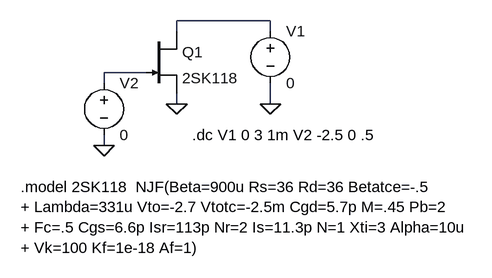
[diagram p0: schematic 2SK118.asc]
2SK118.asc, the LTspice schematic file:
Version 4
SHEET 1 1832 680
WIRE 368 -112 224 -112
WIRE 224 -96 224 -112
WIRE 368 -96 368 -112
WIRE 176 -32 112 -32
WIRE 112 -16 112 -32
WIRE 224 16 224 0
WIRE 368 16 368 -16
WIRE 112 80 112 64
FLAG 368 16 0
FLAG 224 16 0
FLAG 112 80 0
SYMBOL voltage 368 -112 R0
SYMATTR InstName V1
SYMATTR Value 0
SYMBOL njf 176 -96 R0
SYMATTR InstName Q1
SYMATTR Value 2SK118
SYMBOL voltage 112 -32 R0
SYMATTR InstName V2
SYMATTR Value 0
TEXT 248 64 Left 0 !.dc V1 0 3 1m V2 -2.5 0 .5
TEXT -16 144 Left 0 !.model 2SK118  NJF(Beta=900u Rs=36 Rd=36 Betatce=-.5\n+ Lambda=331u Vto=-2.7 Vtotc=-2.5m Cgd=5.7p M=.45 Pb=2\n+ Fc=.5 Cgs=6.6p Isr=113p Nr=2 Is=11.3p N=1 Xti=3 Alpha=10u\n+ Vk=100 Kf=1e-18 Af=1)

The netlist it stands for:
* 2SK118.asc
V1 N001 0 0
J§Q1 N001 N002 0 2SK118
V2 N002 0 0
.model NJF NJF
.model PJF PJF
.lib standard.jft
.dc V1 0 3 1m V2 -2.5 0 .5
.model 2SK118  NJF(Beta=900u Rs=36 Rd=36 Betatce=-.5
+ Lambda=331u Vto=-2.7 Vtotc=-2.5m Cgd=5.7p M=.45 Pb=2
+ Fc=.5 Cgs=6.6p Isr=113p Nr=2 Is=11.3p N=1 Xti=3 Alpha=10u
+ Vk=100 Kf=1e-18 Af=1)
.backanno
.end